# EAGLE design Transceiver (EAGLE 6.4)
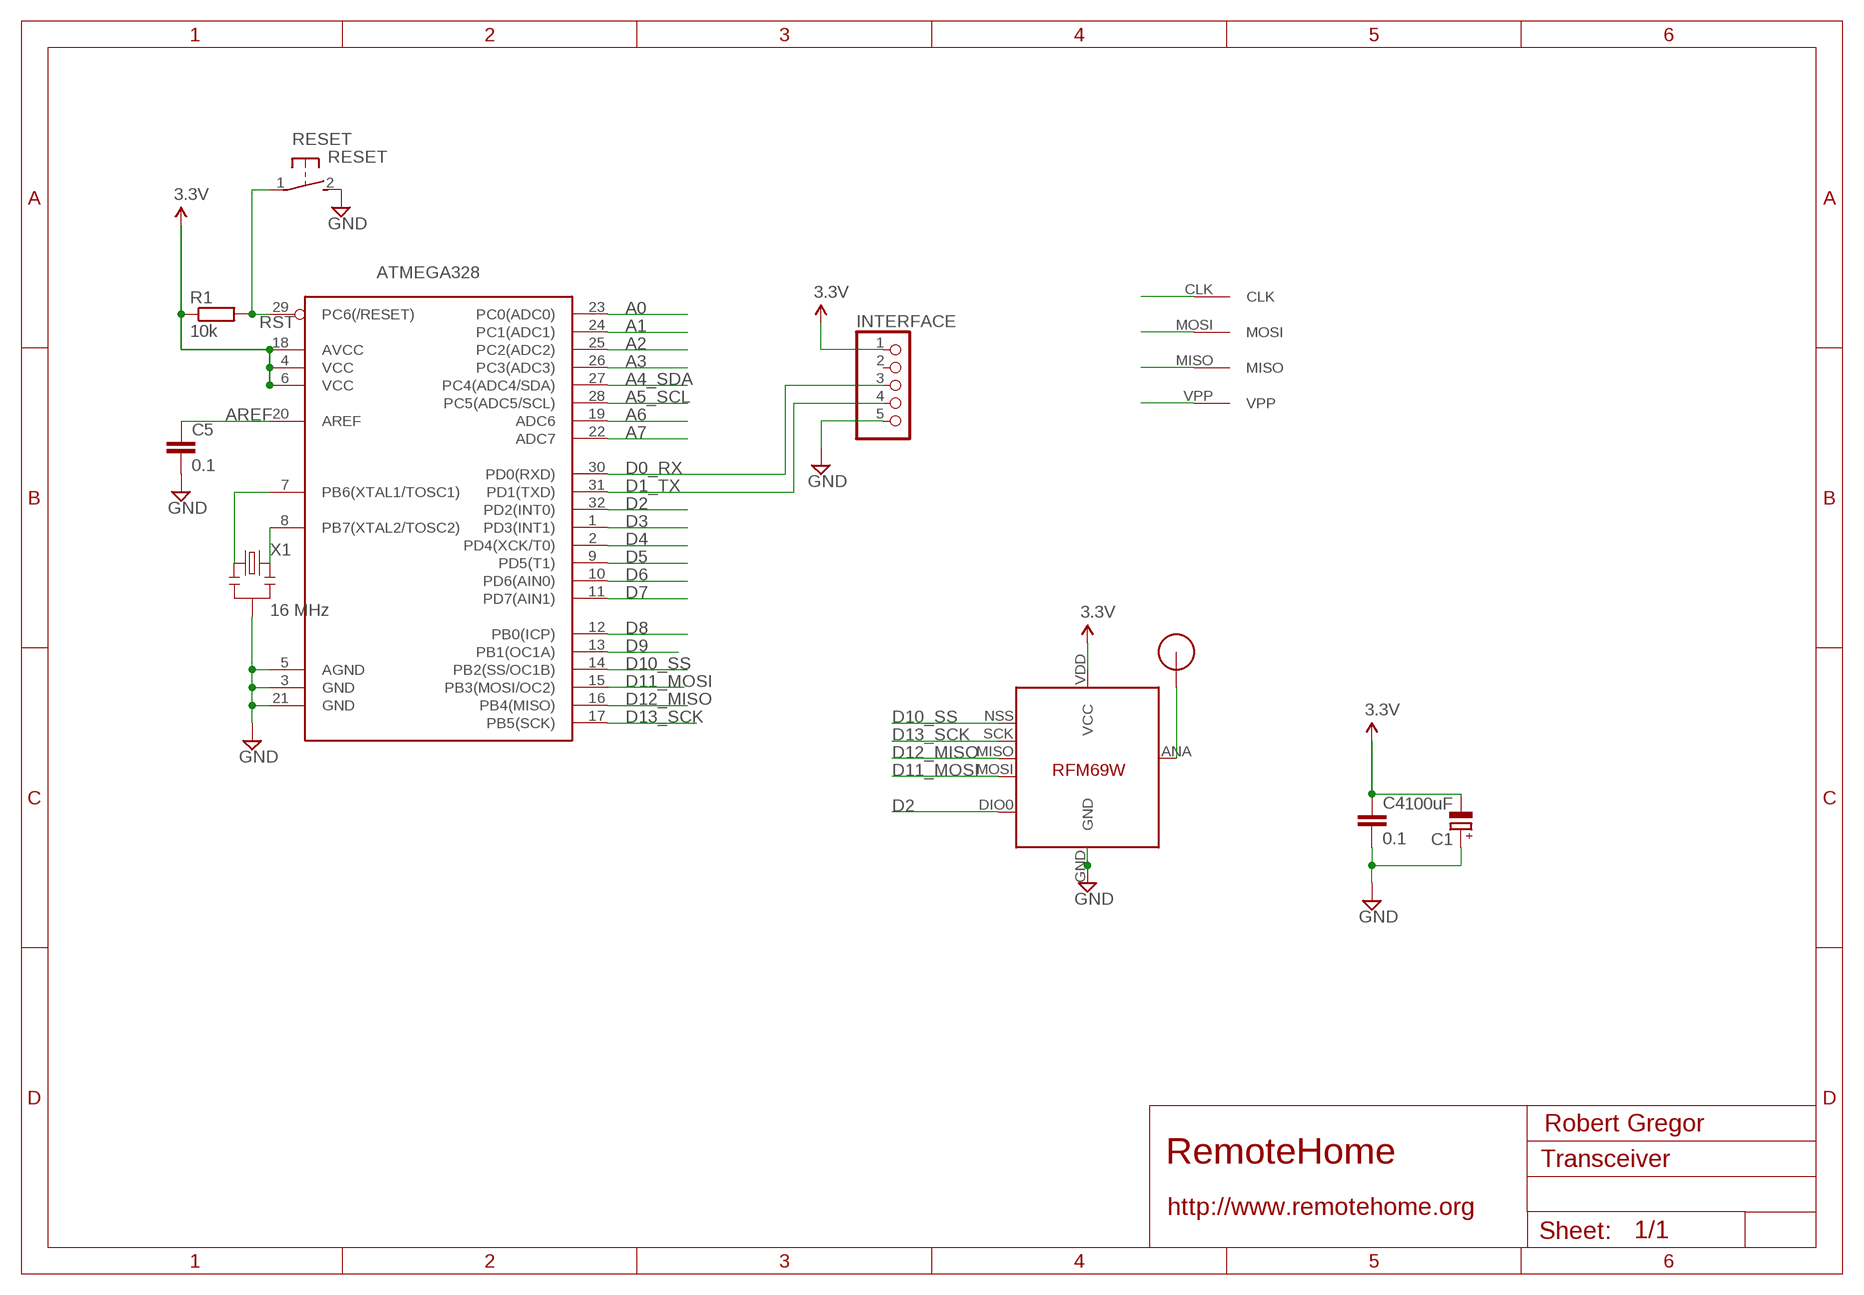
[diagram p0: schematic, sheet 1]

## Parts
ATMEGA328  ATMega-328  ATMEGA168/328TQFP32  [TQFP32-08]
C1  100uF  CPOL-EUSMCB  [SMC_B]
C4  0.1  C-EUC2012  [C2012]
C5  0.1  C-EUC2012  [C2012]
INTERFACE  PINHD-1X05_2.54-S  [1X05-S]
R1  10k  R-EU_R2012  [R2012]
RESET  RESET  DTSM-3  [DTSM-3]
U$1  RFM12B_ANTENNA  [RFM12B-ANTENNA]
U$2  AVRHEADERDIP  [AVRHEADER]
U$5  RFM69  [RFM69W-MINPADS]
X1  16 MHz  RESONATORSMD  [RESONATOR-SMD]

## Nets
A0: ATMEGA328.23(PC0(ADC0))
A1: ATMEGA328.24(PC1(ADC1))
A2: ATMEGA328.25(PC2(ADC2))
A3: ATMEGA328.26(PC3(ADC3))
A4_SDA: ATMEGA328.27(PC4(ADC4/SDA))
A5_SCL: ATMEGA328.28(PC5(ADC5/SCL))
A6: ATMEGA328.19(ADC6)
A7: ATMEGA328.22(ADC7)
AREF: ATMEGA328.20(AREF) C5.1
D0_RX: ATMEGA328.30(PD0(RXD)) INTERFACE.3
D1_TX: ATMEGA328.31(PD1(TXD)) INTERFACE.4
D2: ATMEGA328.32(PD2(INT0)) U$5.DIO0
D3: ATMEGA328.1(PD3(INT1))
D4: ATMEGA328.2(PD4(XCK/T0))
D5: ATMEGA328.9(PD5(T1))
D6: ATMEGA328.10(PD6(AIN0))
D7: ATMEGA328.11(PD7(AIN1))
D8: ATMEGA328.12(PB0(ICP))
D9: ATMEGA328.13(PB1(OC1A))
D10_SS: ATMEGA328.14(PB2(SS/OC1B)) U$5.NSS(SEL)
D11_MOSI: ATMEGA328.15(PB3(MOSI/OC2)) U$2.MOSI U$5.MOSI
D12_MISO: ATMEGA328.16(PB4(MISO)) U$2.MISO U$5.MISO
D13_SCK: ATMEGA328.17(PB5(SCK)) U$2.CLK U$5.SCK
GND [power]: ATMEGA328.3(GND) ATMEGA328.5(AGND) ATMEGA328.21(GND) C1.+ C4.2 C5.2 INTERFACE.5 RESET.2 U$5.GND X1.2
N$1: ATMEGA328.7(PB6(XTAL1/TOSC1)) X1.1
N$3: U$1.P$1 U$5.ANA(ANT)
N$21: ATMEGA328.8(PB7(XTAL2/TOSC2)) X1.3
RST: ATMEGA328.29(PC6(/RESET)) R1.2 RESET.1 U$2.VPP
VCC: ATMEGA328.4(VCC) ATMEGA328.6(VCC) ATMEGA328.18(AVCC) C1.- C4.1 INTERFACE.1 R1.1 U$5.VDD(VCC) ; supply symbol labelled 3.3V
Unconnected: INTERFACE.2

## Notes on the sheet
- Robert Gregor
- RemoteHome
- http://www.remotehome.org

## Library data of the parts
ATMEGA328 = LowPowerLab:ATMEGA168/328: Atmel 32-pin 8-bit micro, 16k flash.
C1 = resistor:CPOL-EU: POLARIZED CAPACITOR, European symbol
C4 C5 = resistor:C-EU: CAPACITOR, European symbol
INTERFACE = pinhead-2:PINHD-1X05: PIN HEADER
R1 = resistor:R-EU_: RESISTOR, European symbol
RESET = switch-tact:DTSM-3
U$1 = LowPowerLab:RFM12B_ANTENNA
U$2 = RemoteHome:AVRHEADER
U$5 = LowPowerLab:RFM69
X1 = SparkFun:RESONATOR: Resonator Small SMD resonator. This is the itty bitty 10/20MHz resonators with built in caps. CSTCE10M0G55 and CSTCE20M0V53. Footprint has been reviewed closely but hasn't been tested yet.

## Net classes
1 power: width 0.381 mm, clearance 0.254 mm

## Board
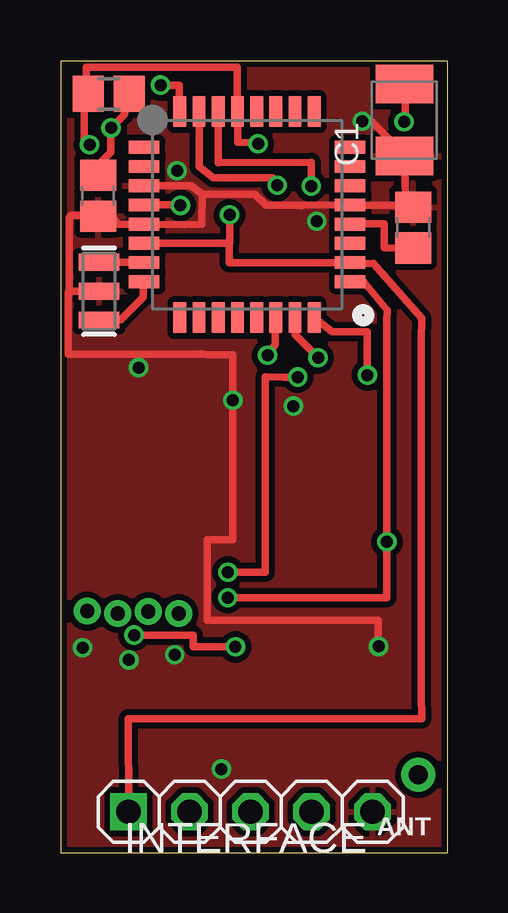
[diagram p1: board, top side]
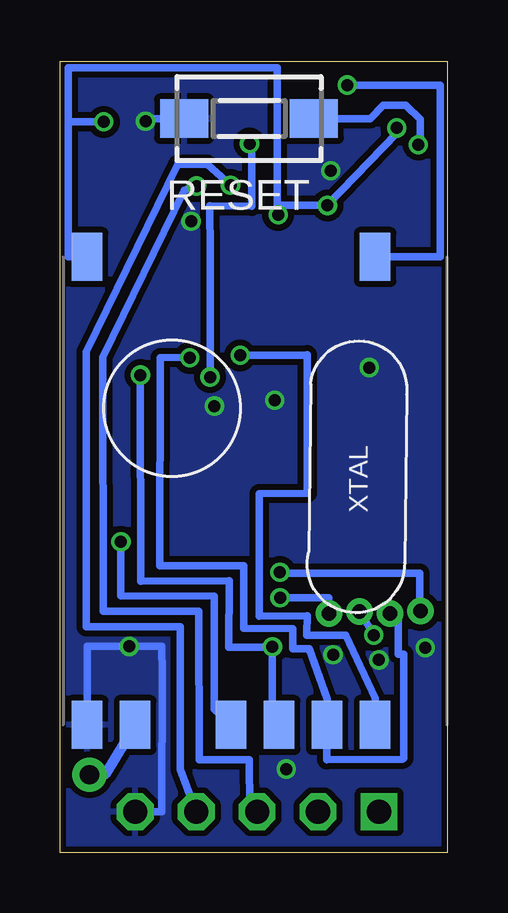
[diagram p2: board, bottom side, seen from below]

Size 16.13 x 32.98 mm. Coordinates in mm from the lower left corner, seen from the top.
Outline: 0,0 16.13,0 16.13,32.98 0,32.98 0,0
Copper layers (1*16): Top 0.035mm / dielectric 1.5mm / Bottom 0.035mm
Design rules "ITEADstudio_DRC": minimum track width 6mil, minimum drill 12mil, track to track 6mil, track to pad 6mil, pad to pad 6mil, via to via 6mil, smd to smd 0mil, copper to edge 10mil, drill to drill 10mil, minimum pad ring 10mil, minimum via ring 6mil, stop-mask expansion 2mil, vias tented up to drill 100mil, thermal gap 10mil

### Footprints (pad centres in the part's own frame; a part is rotated, then mirrored left to right if it is on the bottom)
TQFP32-08 = smd 1.27 x 0.533: 1 -4.293,2.8; 2 -4.293,2; 3 -4.293,1.2; 4 -4.293,0.4; 5 -4.293,-0.4; 6 -4.293,-1.2; 7 -4.293,-2; 8 -4.293,-2.8; 17 4.293,-2.8; 18 4.293,-2; 19 4.293,-1.2; 20 4.293,-0.4; 21 4.293,0.4; 22 4.293,1.2; 23 4.293,2; 24 4.293,2.8 | smd 0.533 x 1.27: 9 -2.8,-4.293; 10 -2,-4.293; 11 -1.2,-4.293; 12 -0.4,-4.293; 13 0.4,-4.293; 14 1.2,-4.293; 15 2,-4.293; 16 2.8,-4.293; 25 2.8,4.293; 26 2,4.293; 27 1.2,4.293; 28 0.4,4.293; 29 -0.4,4.293; 30 -1.2,4.293; 31 -2,4.293; 32 -2.8,4.293
SMC_B = smd 1.6 x 2.4: + -1.5,0; - 1.5,0
C2012 = smd 1.3 x 1.5: 1 -0.85,0; 2 0.85,0
1X05-S = drill 1.016 square: 1 -5.08,0 | drill 1.016 octagon: 2 -2.54,0; 3 0,0; 4 2.54,0; 5 5.08,0
R2012 = smd 1.3 x 1.5: 1 -0.85,0; 2 0.85,0
DTSM-3 = smd 2 x 1.6: 1 -2.7,0; 2 2.7,0
RFM12B-ANTENNA = drill 0.8 pad 1.422: P$1 0,0
AVRHEADER = drill 0.6 pad 0.813: CLK 2.54,0; MISO 1.27,0.091; MOSI 0,0; VPP -1.27,0.099
RFM69W-MINPADS = smd 2 x 1.27: ANA 8,-5; DIO0 -11.5,5; GND 8,-7; MISO 8,1; MOSI 8,3; NSS 8,5; SCK 8,-1; VDD -11.5,-7
RESONATOR-SMD = smd 0.7 x 1.7: 1 -1.2,0; 2 0,0; 3 1.2,0

### Placement (x,y rotation side)
ATMEGA328  7.76,26.59 0 top
C1  14.32,30.52 90 top
C4  1.56,27.37 270 top
C5  14.69,26.05 90 top
INTERFACE  7.91,1.71 0 top
R1  2,31.62 180 top
RESET  8.25,30.59 180 bottom
U$1  14.9,3.25 0 top
U$2  2.38,9.96 0 top
U$5  8,13.32 270 bottom
X1  1.6,23.4 270 top

### Tracks (layer width: path | path; a pad name or v marks a point on that pad's centre or on a via)
AREF
  Top 0.305: C5.1 13.49,25.21 13.49,26.21 12.63,26.21 ATMEGA328.20
D0_RX  (via drill 0.5)
  Top 0.305: ATMEGA328.30 6.56,28.75 10.44,28.77 v10.44,27.78
  Bottom 0.305: v10.44,27.78 10.96,27.6 14.34,20.65 14.32,10.05 10.36,10.05 10.34,3.88 8.23,3.88 8.22,1.86 INTERFACE.3
D1_TX  (via drill 0.5)
  Top 0.305: v9.02,27.81 8.81,28.12 6.37,28.12 5.76,28.58 ATMEGA328.31
  Bottom 0.305: INTERFACE.4 10.52,1.86 11.12,3.48 11.12,9.41 15.03,9.41 15.03,20.87 11.21,28.68 10,28.68 v9.02,27.81
D2  (via drill 0.5)
  Top 0.305: v4.16,31.98 4.94,31.98 ATMEGA328.32
  Bottom 0.305: v4.16,31.98 0.28,31.97 0.29,29.85 0.29,29.63 0.29,24.82 U$5.DIO0
D10_SS  (via drill 0.5)
  Top 0.305: v8.62,20.73 8.94,21.2 ATMEGA328.14
  Bottom 0.305: U$5.NSS 3,6.43 4.23,9.06 5.84,9.07 5.84,9.17 5.84,9.87 7.82,9.86 7.82,9.97 7.83,14.96 5.83,14.97 5.83,20.75 5.84,20.73 6.62,20.73 v8.62,20.73
D11_MOSI  (via drill 0.5)
  Top 0.305: ATMEGA328.15 9.76,21.59 v10.73,20.62
  Bottom 0.305: v10.73,20.62 10.91,20.64 11.95,20.63 11.96,11.95 8.47,11.95 8.47,9.35 6.44,9.34 6.44,8.51 5.75,8.51 5,6.4 U$5.MOSI 5.02,3.87 1.86,3.89 1.81,3.93 1.81,8.27 2.04,8.27 2.04,9.97 2.02,9.97 U$2.MOSI
D12_MISO  (via drill 0.5)
  Top 0.305: v12.78,19.9 12.77,21.71 11.32,21.71 ATMEGA328.16 | v3.06,9.07 5.53,9.07 5.53,8.58 v7.28,8.58
  Bottom 0.305: U$5.MISO 7.29,5.46 | 7.29,5.46 7.29,8.57 9.1,8.56 9.08,11.32 12.77,11.31 v12.78,19.9 | U$2.MISO 3.62,10.03 v3.06,9.07 | v7.28,8.58 7.28,6.35 7.29,5.46
D13_SCK  (via drill 0.5)
  Top 0.305: ATMEGA328.17 12.62,23.79 13.6,22.61 13.6,22.58 13.59,22.17 v13.59,12.95 13.59,10.62 v6.96,10.62
  Bottom 0.305: U$5.SCK 9.71,5.97 9.71,10.7 13.59,10.71 v13.59,12.95 | U$2.CLK 4.93,10.63 v6.96,10.62
GND  (via drill 0.5)
  Top 0.305: 4.03,26.21 ATMEGA328.5 | ATMEGA328.3 5.44,27.8 5.9,27.44 | 5.9,27.44 5.88,26.19 5.16,26.18 ATMEGA328.5 | 8.57,26.99 ATMEGA328.21 12.63,26.97 13.05,26.97 14.55,26.97 C5.2 14.38,27.34 C1.+ 13.79,29.44 13.79,29.62 12.93,30.48 v12.56,30.48 | 8.57,26.99 8.09,27.43 5.9,27.44 | 10.03,26.95 8.57,26.99 | v13.24,8.6 13.22,8.45 13.24,9.68 6.11,9.69 6.11,13.03 7.18,13.03 7.18,20.75 6.12,20.75 6,20.76 5.82,20.78 5.82,20.76 0.32,20.77 0.32,23.36 | 0.35,23.42 X1.2 0.43,23.37 0.32,23.36 | 0.35,23.42 0.32,23.36 | ATMEGA328.5 2.43,26.18 2.09,26.52 C4.2 1.53,26.56 0.45,26.56 0.35,26.48 0.35,23.42
  Bottom 0.305: 14.5,5.32 U$5.GND 15,8.59 v13.24,8.6 11.88,8.59 11.88,7.46 11.9,1.7 INTERFACE.5 | RESET.2 12.46,30.59 v12.56,30.48
  other vias: 9.69,18.61 4.75,8.25 0.91,8.54 2.84,8.03 6.7,3.48 7.18,18.85 3.24,20.21 4.85,28.41 10.67,26.31
  pour Bottom: 0.15,32.86 15.99,32.82 15.97,0.14 0.14,0.14 0.14,29.88
  pour Top: 15.97,32.86 15.99,29.89 15.99,0.14 0.16,0.14 0.15,32.88
N$1
  Top 0.305: X1.1 ATMEGA328.7
N$3
  Bottom 0.406: U$5.ANA 14.24,3.26 U$1.P$1
N$21
  Top 0.305: X1.3 2.5,22.2 3.44,23.14 3.44,23.76 ATMEGA328.8
RST  (via drill 0.5)
  Top 0.305: v6.96,11.69 8.51,11.69 8.51,19.83 9.29,19.81 v9.87,19.82 | v8.23,29.54 8.2,29.54 8.28,29.59 7.37,29.6 ATMEGA328.29 7.36,32.73 1.05,32.73 1.05,31.87 R1.2 0.98,31.41 0.98,29.47 v1.2,29.5
  Bottom 0.305: U$2.VPP 1.14,10.04 1.14,11.65 6.96,11.65 v6.96,11.69 | v9.87,19.82 9.87,20.76 9.87,24.99 9.88,26.96 8.14,26.95 8.14,29.26 v8.23,29.54 | RESET.1 3.21,30.59 2.65,31.14 1.72,31.14 1.13,30.55 1.13,29.4 v1.2,29.5
VCC  (via drill 0.5)
  Top 0.305: v4.99,26.97 4.82,26.99 ATMEGA328.4 4.03,26.97 3.21,26.97 | ATMEGA328.6 7.03,25.39 7.04,25.46 v7.04,26.58 7.03,24.59 ATMEGA328.18 12.61,24.56 12.65,24.55 13.02,24.56 15.04,22.27 15.02,21.33 15.02,6.61 15.04,5.57 2.82,5.59 INTERFACE.1 | R1.1 2.64,30.75 v2.1,30.2 2.08,30.18 2.08,29.18 1.56,28.66 C4.1 | C1.- 14.38,30.48 v14.31,30.46
  Bottom 0.305: 7.09,26.97 v4.99,26.97 2.1,29.98 v2.1,30.2 | 7.09,26.97 7.09,32.72 15.79,32.72 15.79,30.46 | 15.79,30.46 15.78,26.6 15.78,24.82 U$5.VDD | v7.04,26.58 7.09,26.97 | v14.31,30.46 15,30.46 15.79,30.46

### Text on the board
_tsilk: ANT